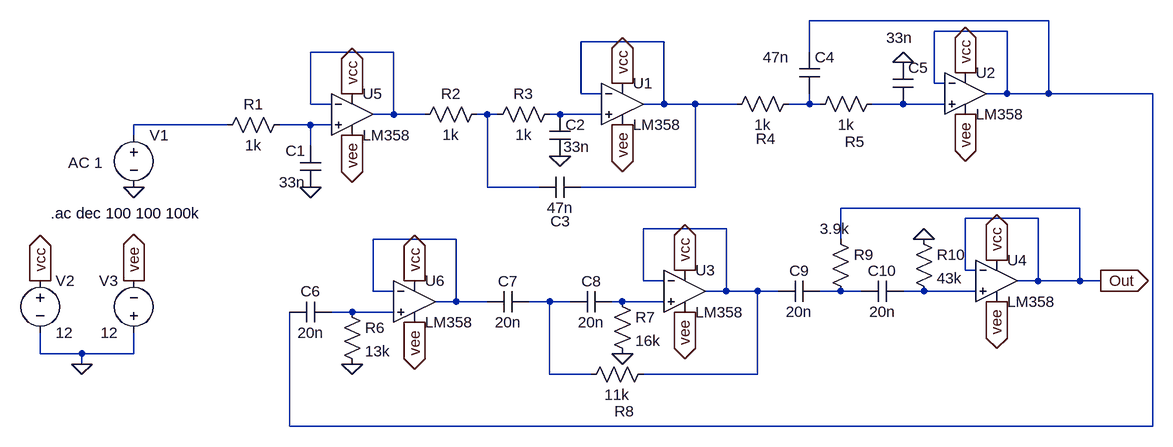
[diagram p0: schematic Pass-band-filter.asc]
Pass-band-filter.asc, the LTspice schematic file:
Version 4
SHEET 1 1764 692
WIRE 608 -304 240 -304
WIRE 544 -288 432 -288
WIRE 16 -272 -112 -272
WIRE -400 -256 -528 -256
WIRE 240 -256 240 -304
WIRE 432 -208 432 -288
WIRE 448 -208 432 -208
WIRE -112 -192 -112 -272
WIRE -80 -192 -112 -192
WIRE 544 -192 544 -288
WIRE 544 -192 512 -192
WIRE 608 -192 608 -304
WIRE 608 -192 544 -192
WIRE 768 -192 608 -192
WIRE -528 -176 -528 -256
WIRE -496 -176 -528 -176
WIRE 16 -176 16 -272
WIRE 16 -176 -16 -176
WIRE 64 -176 16 -176
WIRE 128 -176 64 -176
WIRE 240 -176 240 -192
WIRE 240 -176 208 -176
WIRE 256 -176 240 -176
WIRE 384 -176 336 -176
WIRE 448 -176 384 -176
WIRE -400 -160 -400 -256
WIRE -400 -160 -432 -160
WIRE -352 -160 -400 -160
WIRE -256 -160 -272 -160
WIRE -240 -160 -256 -160
WIRE -144 -160 -160 -160
WIRE -80 -160 -144 -160
WIRE -656 -144 -800 -144
WIRE -528 -144 -576 -144
WIRE -496 -144 -528 -144
WIRE -800 -128 -800 -144
WIRE -528 -112 -528 -144
WIRE -256 -48 -256 -160
WIRE -176 -48 -256 -48
WIRE 64 -48 64 -176
WIRE 64 -48 -112 -48
WIRE 656 -16 288 -16
WIRE 592 0 480 0
WIRE 112 16 -16 16
WIRE -304 32 -432 32
WIRE 288 32 288 -16
WIRE 480 80 480 0
WIRE 496 80 480 80
WIRE -16 96 -16 16
WIRE 16 96 -16 96
WIRE 592 96 592 0
WIRE 592 96 560 96
WIRE 656 96 656 -16
WIRE 656 96 592 96
WIRE 688 96 656 96
WIRE -432 112 -432 32
WIRE -400 112 -432 112
WIRE 112 112 112 16
WIRE 112 112 80 112
WIRE 160 112 112 112
WIRE 192 112 160 112
WIRE 288 112 256 112
WIRE 320 112 288 112
WIRE 416 112 384 112
WIRE 496 112 416 112
WIRE -304 128 -304 32
WIRE -304 128 -336 128
WIRE -256 128 -304 128
WIRE -160 128 -192 128
WIRE -128 128 -160 128
WIRE -48 128 -64 128
WIRE 16 128 -48 128
WIRE -464 144 -496 144
WIRE -400 144 -464 144
WIRE -944 208 -944 176
WIRE -880 208 -944 208
WIRE -800 208 -800 176
WIRE -800 208 -880 208
WIRE -880 224 -880 208
WIRE -160 240 -160 128
WIRE -96 240 -160 240
WIRE 160 240 160 112
WIRE 160 240 -16 240
WIRE -560 320 -560 144
WIRE 768 320 768 -192
WIRE 768 320 -560 320
FLAG 384 -240 0
FLAG -144 -96 0
FLAG 480 -224 vcc
IOPIN 480 -224 Out
FLAG -48 -208 vcc
IOPIN -48 -208 Out
FLAG -48 -144 vee
IOPIN -48 -144 Out
FLAG 480 -160 vee
IOPIN 480 -160 Out
FLAG -800 -48 0
FLAG -944 96 vcc
IOPIN -944 96 Out
FLAG -800 96 vee
IOPIN -800 96 Out
FLAG -880 224 0
FLAG 48 80 vcc
IOPIN 48 80 Out
FLAG 48 144 vee
IOPIN 48 144 Out
FLAG 528 64 vcc
IOPIN 528 64 Out
FLAG 528 128 vee
IOPIN 528 128 Out
FLAG -48 208 0
FLAG 416 32 0
FLAG 688 96 Out
IOPIN 688 96 Out
FLAG -464 -192 vcc
IOPIN -464 -192 Out
FLAG -464 -128 vee
IOPIN -464 -128 Out
FLAG -528 -48 0
FLAG -368 96 vcc
IOPIN -368 96 Out
FLAG -368 160 vee
IOPIN -368 160 Out
FLAG -464 224 0
SYMBOL res 352 -192 R90
WINDOW 0 90 42 VBottom 2
WINDOW 3 32 56 VTop 2
SYMATTR InstName R5
SYMATTR Value 1k
SYMBOL cap 368 -240 R0
WINDOW 3 -10 -38 Left 2
SYMATTR Value 33n
SYMATTR InstName C5
SYMBOL res -144 -176 R90
WINDOW 0 0 56 VBottom 2
WINDOW 3 32 56 VTop 2
SYMATTR InstName R3
SYMATTR Value 1k
SYMBOL cap -160 -160 R0
WINDOW 3 21 50 Left 2
WINDOW 0 24 16 Left 2
SYMATTR Value 33n
SYMATTR InstName C2
SYMBOL cap -112 -64 R90
WINDOW 0 84 31 VBottom 2
WINDOW 3 32 32 VTop 2
SYMATTR InstName C3
SYMATTR Value 47n
SYMBOL cap 224 -256 R0
WINDOW 3 -56 8 Left 2
SYMATTR Value 47n
SYMATTR InstName C4
SYMBOL res 224 -192 R90
WINDOW 0 85 51 VBottom 2
WINDOW 3 32 56 VTop 2
SYMATTR InstName R4
SYMATTR Value 1k
SYMBOL voltage -800 -144 R0
WINDOW 123 -101 58 Left 2
WINDOW 39 0 0 Left 0
SYMATTR Value2 AC 1
SYMATTR InstName V1
SYMATTR Value ""
SYMBOL res -256 -176 R90
WINDOW 0 0 56 VBottom 2
WINDOW 3 32 56 VTop 2
SYMATTR InstName R2
SYMATTR Value 1k
SYMBOL voltage -944 80 R0
WINDOW 123 0 0 Left 0
WINDOW 39 0 0 Left 0
SYMATTR InstName V2
SYMATTR Value 12
SYMBOL voltage -800 192 R180
WINDOW 0 24 96 Left 2
WINDOW 3 24 16 Left 2
WINDOW 123 0 0 Left 0
WINDOW 39 0 0 Left 0
SYMATTR InstName V3
SYMATTR Value 12
SYMBOL cap -192 112 R90
WINDOW 0 0 32 VBottom 2
WINDOW 3 32 32 VTop 2
SYMATTR InstName C7
SYMATTR Value 20n
SYMBOL cap -64 112 R90
WINDOW 0 0 32 VBottom 2
WINDOW 3 32 32 VTop 2
SYMATTR InstName C8
SYMATTR Value 20n
SYMBOL res -64 112 R0
SYMATTR InstName R7
SYMATTR Value 16k
SYMBOL res 0 224 R90
WINDOW 0 88 45 VBottom 2
WINDOW 3 32 56 VTop 2
SYMATTR InstName R8
SYMATTR Value 11k
SYMBOL cap 256 96 R90
WINDOW 0 0 32 VBottom 2
WINDOW 3 32 32 VTop 2
SYMATTR InstName C9
SYMATTR Value 20n
SYMBOL cap 384 96 R90
WINDOW 0 0 32 VBottom 2
WINDOW 3 32 32 VTop 2
SYMATTR InstName C10
SYMATTR Value 20n
SYMBOL res 400 16 R0
SYMATTR InstName R10
SYMATTR Value 43k
SYMBOL res 272 16 R0
WINDOW 3 -16 0 Left 2
SYMATTR Value 3.9k
SYMATTR InstName R9
SYMBOL Opamps\\LM358 -48 -240 R0
SYMATTR InstName U1
SYMBOL Opamps\\LM358 480 -256 R0
SYMATTR InstName U2
SYMBOL Opamps\\LM358 48 48 R0
SYMATTR InstName U3
SYMBOL Opamps\\LM358 528 32 R0
SYMATTR InstName U4
SYMBOL res -560 -160 R90
WINDOW 0 0 56 VBottom 2
WINDOW 3 32 56 VTop 2
SYMATTR InstName R1
SYMATTR Value 1k
SYMBOL cap -512 -48 R180
WINDOW 0 24 56 Left 2
WINDOW 3 24 8 Left 2
SYMATTR InstName C1
SYMATTR Value 33n
SYMBOL Opamps\\LM358 -464 -224 R0
SYMATTR InstName U5
SYMBOL res -480 128 R0
SYMATTR InstName R6
SYMATTR Value 13k
SYMBOL Opamps\\LM358 -368 64 R0
SYMATTR InstName U6
SYMBOL cap -496 128 R90
WINDOW 0 0 32 VBottom 2
WINDOW 3 32 32 VTop 2
SYMATTR InstName C6
SYMATTR Value 20n
TEXT -928 -8 Left 2 !.ac dec 100 100 100k

The netlist it stands for:
* Pass-band-filter.asc
R5 N005 N004 1k
C5 0 N005 33n
R3 N007 N006 1k
C2 N007 0 33n
C3 N002 N006 47n
C4 N001 N004 47n
R4 N004 N002 1k
V1 N008 0 AC 1
R2 N006 N003 1k
V2 vcc 0 12
V3 0 vee 12
C7 N014 N011 20n
C8 N015 N014 20n
R7 N015 0 16k
R8 N010 N014 11k
C9 N012 N010 20n
C10 N013 N012 20n
R10 0 N013 43k
R9 Out N012 3.9k
XU1 N007 N002 vcc vee N002 LM358  ; pins In+ In- V+ V- OUT
XU2 N005 N001 vcc vee N001 LM358  ; pins In+ In- V+ V- OUT
XU3 N015 N010 vcc vee N010 LM358  ; pins In+ In- V+ V- OUT
XU4 N013 Out vcc vee Out LM358  ; pins In+ In- V+ V- OUT
R1 N009 N008 1k
C1 0 N009 33n
XU5 N009 N003 vcc vee N003 LM358  ; pins In+ In- V+ V- OUT
R6 N016 0 13k
XU6 N016 N011 vcc vee N011 LM358  ; pins In+ In- V+ V- OUT
C6 N016 N001 20n
.ac dec 100 100 100k
.backanno
.end